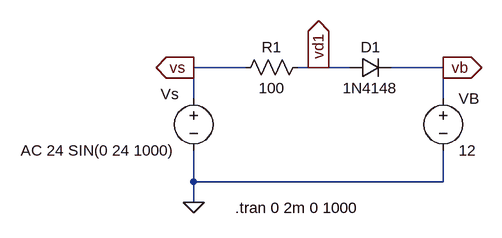
[diagram p0: schematic exam2_01.asc]
exam2_01.asc, the LTspice schematic file:
Version 4
SHEET 1 880 680
WIRE 112 96 32 96
WIRE 224 96 192 96
WIRE 272 96 224 96
WIRE 416 96 336 96
WIRE 32 144 32 96
WIRE 416 144 416 96
WIRE 32 272 32 224
WIRE 416 272 416 224
WIRE 416 272 32 272
WIRE 32 304 32 272
FLAG 32 304 0
FLAG 32 96 vs
IOPIN 32 96 Out
FLAG 224 96 vd1
IOPIN 224 96 Out
FLAG 416 96 vb
IOPIN 416 96 Out
SYMBOL res 208 80 R90
WINDOW 0 0 56 VBottom 2
WINDOW 3 32 56 VTop 2
SYMATTR InstName R1
SYMATTR Value 100
SYMBOL diode 272 112 R270
WINDOW 0 32 32 VTop 2
WINDOW 3 0 32 VBottom 2
SYMATTR InstName D1
SYMATTR Value 1N4148
SYMBOL voltage 416 128 R0
SYMATTR InstName VB
SYMATTR Value 12
SYMBOL voltage 32 128 R0
WINDOW 0 -51 9 Left 2
WINDOW 3 -266 96 Left 2
SYMATTR InstName Vs
SYMATTR Value AC 24 SIN(0 24 1000)
TEXT 96 312 Left 2 !.tran 0 2m 0 1000

The netlist it stands for:
* exam2_01.asc
R1 vd1 vs 100
D1 vd1 vb 1N4148
VB vb 0 12
Vs vs 0 AC 24 SIN(0 24 1000)
.model D D
.lib standard.dio
.tran 0 2m 0 1000
.backanno
.end